# Altium schematic sheet lan8742_daughterboard_EF.SchDoc
size A2
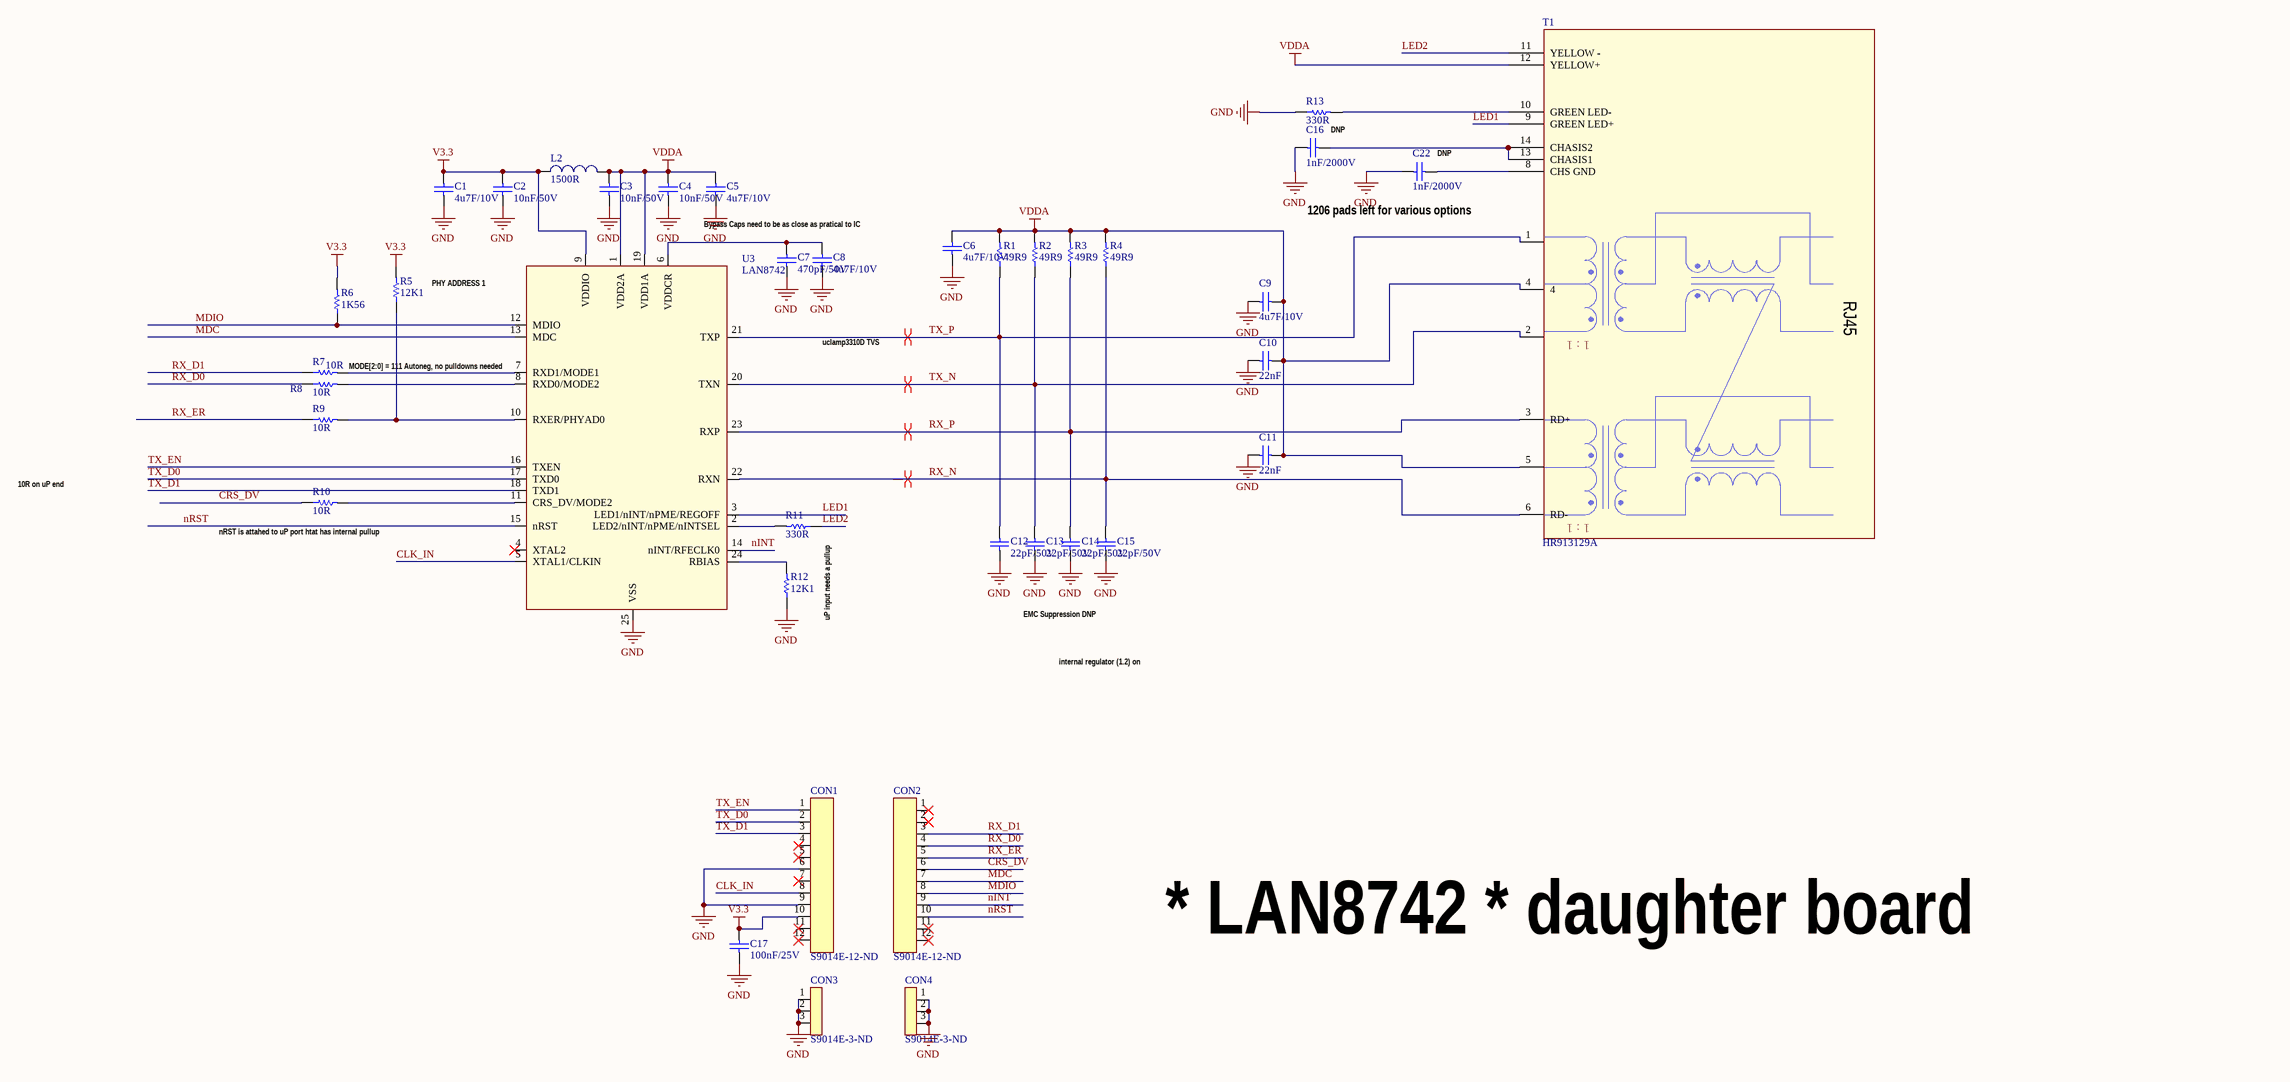
[diagram p0: lan8742_daughterboard_EF.SchDoc]

## Parts
C1  Part_Value: 4u7F/10V  [CAP_0603]  (hidden comment: CAP)
C2  Part_Value: 10nF/50V  [CAP_0603]  (hidden comment: CAP)
C3  Part_Value: 10nF/50V  [CAP_0603]  (hidden comment: CAP)
C4  Part_Value: 10nF/50V  [CAP_0603]  (hidden comment: CAP)
C5  Part_Value: 4u7F/10V  [CAP_0603]  (hidden comment: CAP)
C6  Part_Value: 4u7F/10V  [CAP_0603]  (hidden comment: CAP)
C7  Part_Value: 470pF/50V  [CAP_0603]  (hidden comment: CAP)
C8  Part_Value: 4u7F/10V  [CAP_0603]  (hidden comment: CAP)
C9  Part_Value: 4u7F/10V  [CAP_0603]  (hidden comment: CAP)
C10  Part_Value: 22nF  [CAP_0603]  (hidden comment: CAP)
C11  Part_Value: 22nF  [CAP_0603]  (hidden comment: CAP)
C12  Part_Value: 22pF/50V  [CAP_0603]  (hidden comment: CAP)
C13  Part_Value: 22pF/50V  [CAP_0603]  (hidden comment: CAP)
C14  Part_Value: 22pF/50V  [CAP_0603]  (hidden comment: CAP)
C15  Part_Value: 22pF/50V  [CAP_0603]  (hidden comment: CAP)
C16  Part_Value: 1nF/2000V  [CAP_1206]  (hidden comment: CAP)
C17  Part_Value: 100nF/25V  [CAP_0603]  (hidden comment: CAP)
C22  Part_Value: 1nF/2000V  [CAP_1206]  (hidden comment: CAP)
CON1  S9014E-12-ND  [S9014E-12-ND]
CON2  S9014E-12-ND  [S9014E-12-ND]
CON3  S9014E-3-ND  [S9014E-3-ND]
CON4  S9014E-3-ND  [S9014E-3-ND]
L2  Part_Value: 1500R  [SMD-0805]  (hidden comment: INDUCTOR)
R1  Part_Value: 49R9  [RES_0603]  (hidden comment: RES)
R2  Part_Value: 49R9  [RES_0603]  (hidden comment: RES)
R3  Part_Value: 49R9  [RES_0603]  (hidden comment: RES)
R4  Part_Value: 49R9  [RES_0603]  (hidden comment: RES)
R5  Part_Value: 12K1  [RES_0603]  (hidden comment: RES)
R6  Part_Value: 1K56  [RES_0603]  (hidden comment: RES)
R7  Part_Value: 10R  [RES_0603]  (hidden comment: RES)
R8  Part_Value: 10R  [RES_0603]  (hidden comment: RES)
R9  Part_Value: 10R  [RES_0603]  (hidden comment: RES)
R10  Part_Value: 10R  [RES_0603]  (hidden comment: RES)
R11  Part_Value: 330R  [RES_0603]  (hidden comment: RES)
R12  Part_Value: 12K1  [RES_0603]  (hidden comment: RES)
R13  Part_Value: 330R  [RES_0603]  (hidden comment: RES)
T1  HR913129A  [HR913129A]
U3  LAN8742  [LAN8742]

## Nets
GND: C1.1 C2.1 C3.1 C4.1 C5.1 C6.1 C7.1 C8.1 C9.1 C10.2 C11.2 C12.1 C13.1 C14.1 C15.1 C16.1 C17.1 C22.1 CON1.6 CON1.9 CON3.1 CON3.2 CON3.3 CON4.1 CON4.2 CON4.3 R12.1 R13.1 U3.25(VSS)
V3.3: C1.2 C2.2 C17.2 CON1.10 L2.1 R5.2 R6.2 U3.9(VDDIO)
VDDA: C3.2 C4.2 C5.2 C6.2 C9.2 C10.1 C11.1 L2.2 R1.2 R2.2 R3.2 R4.2 T1.4 T1.5 T1.12(YELLOW+) U3.1(VDD2A) U3.19(VDD1A)
CLK_IN: CON1.8 U3.5(XTAL1/CLKIN)
CRS_DV: CON2.6 R10.1
LED1: T1.9(GREEN_LED+) U3.3(LED1/nINT/nPME/REGOFF)
LED2: R11.1 T1.11(YELLOW_-)
MDC: CON2.7 U3.13(MDC)
MDIO: CON2.8 R6.1 U3.12(MDIO)
nINT: CON2.9 U3.14(nINT/RFECLK0)
nRST: CON2.10 U3.15(nRST)
RX_D0: CON2.4 R8.1
RX_D1: CON2.3 R7.1
RX_ER: CON2.5 R9.1
RX_N: C15.2 R4.1 T1.6(RD-) U3.22(RXN)
RX_P: C14.2 R3.1 T1.3(RD+) U3.23(RXP)
TX_D0: CON1.2 U3.17(TXD0)
TX_D1: CON1.3 U3.18(TXD1)
TX_EN: CON1.1 U3.16(TXEN)
TX_N: C13.2 R2.1 T1.2(TD-) U3.20(TXN)
TX_P: C12.2 R1.1 T1.1(TD+) U3.21(TXP)
NetC7_2: C7.2 C8.2 U3.6(VDDCR)
NetC16_2: C16.2 T1.13(CHASIS1) T1.14(CHASIS2)
NetC22_2: C22.2 T1.8(CHS_GND)
NetR5_1: R5.1 R9.2 U3.10(RXER/PHYAD0)
NetR7_2: R7.2 U3.7(RXD1/MODE1)
NetR8_2: R8.2 U3.8(RXD0/MODE2)
NetR10_2: R10.2 U3.11(CRS_DV/MODE2)
NetR11_2: R11.2 U3.2(LED2/nINT/nPME/nINTSEL)
NetR12_2: R12.2 U3.24(RBIAS)
NetR13_2: R13.2 T1.10(GREEN_LED-)

Not connected (* = marked no-connect by the designer): CON1 4* 5* 7* 11* 12*; CON2 1* 2* 11* 12*; U3 4(XTAL2)*

## Layout directives
differential pair: RX_N, RX_P, TX_N, TX_P

## Notes on the sheet
- DNP
- (near C22) DNP
- Bypass Caps need to be as close as pratical to IC
- (near T1) 1206 pads left for various options
- PHY ADDRESS 1
- (near U3) MODE[2:0] = 111 Autoneg, no pulldowns needed
- uclamp3310D TVS
- 10R on uP end
- (near R10) nRST is attahed to uP port htat has internal pullup
- (near R11) uP input needs a pullup
- EMC Suppression DNP
- internal regulator (1.2) on
- * LAN8742 * daughter board
- (in symbol HR913129A) 1 : 1; RJ45

## Library data of the parts
C1 C5 C6 C8 C9 = CAP_4u7F/10V_0603: Part_Group_Name: Capacitors; value_numeric: 4.7E-6; Placement_Type: 1; static_cmp: 40; Installed: False; Part Number: CAP_4u7F/10V_0603; Size: 603; Machine: 1; Price: 0.05
C2-C4 = CAP_10nF/50V_0603: Part_Group_Name: Capacitors; value_numeric: 1E-8; Placement_Type: 1; static_cmp: 42; Installed: False; Part Number: CAP_10nF/50V_0603; Size: 603; Machine: 1; Price: 0.05
C7 = CAP_470pF/50V_0603: 470pF Ceramic; Part_Group_Name: Capacitors; value_numeric: 4.7E-11; Placement_Type: 1; static_cmp: 38; Installed: False; Part Number: CAP_470pF/50V_0603; Size: 603; Machine: 1; Price: 0.05
C10 C11 = CAP_22nF/50V_0603: Part_Group_Name: Capacitors; value_numeric: 0; Placement_Type: 1; Part Number: CAP_22nF/50V_0603; Size: 0; Price: 0
C12-C15 = CAP_22pF/50V_0603: Part_Group_Name: Capacitors; value_numeric: 2.2E-11; Placement_Type: 6; Machine: 1; static_cmp: 50; Installed: False; Part Number: CAP_22pF/50V_0603; Size: 603; Price: 0.05
C16 C22 = CAP_1nF/2000V_1206: Part_Group_Name: Capacitors; value_numeric: 1E-9; Placement_Type: 6; Machine: 1; static_cmp: 41; Installed: False; Part Number: CAP_1nF/2000V_1206; Size: 1206; Price: 0.05
C17 = CAP_100nF/25V_0603: Part_Group_Name: Capacitors; value_numeric: 0; Placement_Type: 1; Part Number: CAP_100nF/25V_0603; Size: 0; Price: 0
CON1 CON2 = S9014E-12-ND: 12 way .05" header plug; Part_Group_Name: Connector; value_numeric: 0; Placement_Type: 2; Part Number: S9014E-12-ND; Part_Value: S9014E-12-ND
CON3 CON4 = S9014E-3-ND: 3 way .05" header; Part_Group_Name: Connector; value_numeric: 0; Placement_Type: 2; Part Number: S9014E-3-ND; Part_Value: S9014E-3-ND
L2 = FER_1500R: SMD EMI Suppression Ferrite Bead WE-CBF, Z = 1500 Ohm; Part_Group_Name: Inductors; value_numeric: 1500; Placement_Type: 1; static_cmp: 27; Installed: False; Part Number: FER_1500R; Size: 805; Machine: 1; Price: 0.15
R1-R4 = RES_49R9_0603: 49R9 .1W 1% SMD; Part_Group_Name: Resistors; value_numeric: 49; Placement_Type: 1; static_cmp: 5; Installed: False; Part Number: RES_49R9_0603; Size: 603; Machine: 1; Price: 0.0025
R5 = RES_12K1_0603: 12k1 .1W 1% SMD; Part_Group_Name: Resistors; value_numeric: 12100; Placement_Type: 5; Machine: 1; static_cmp: 4; Installed: False; Part Number: RES_12K1_0603; Size: 603; Price: 0.0025
R6 = RES_1K56_0603: 1K58 .1W 1% SMD; Part_Group_Name: Resistors; value_numeric: 1560; Placement_Type: 1; static_cmp: 8; Installed: False; Part Number: RES_1K56_0603; Size: 603; Machine: 1; Price: 0.0025
R7-R10 = RES_10R_0603: Part_Group_Name: Resistors; value_numeric: 0; Placement_Type: 1; Part Number: RES_10R_0603; Size: 0; Price: 0
R11 R13 = RES_330R_0603: Part_Group_Name: Resistors; value_numeric: 0; Placement_Type: 1; Part Number: RES_330R_0603; Size: 0; Price: 0
R12 = RES_12K1_0603: 12k1 .1W 1% SMD; Part_Group_Name: Resistors; value_numeric: 12100; Placement_Type: 1; static_cmp: 4; Installed: False; Part Number: RES_12K1_0603; Size: 603; Machine: 1; Price: 0.0025
T1 = HR913129A: Part_Group_Name: Transformers; Placement_Type: 4; Part Number: HR913129A
U3 = LAN8742: Lan8742 RMMI PHY; Part_Value: 8742; Part_Group_Name: Special_function_device; Placement_Type: 1; Part Number: LAN8742; value_numeric: 8742